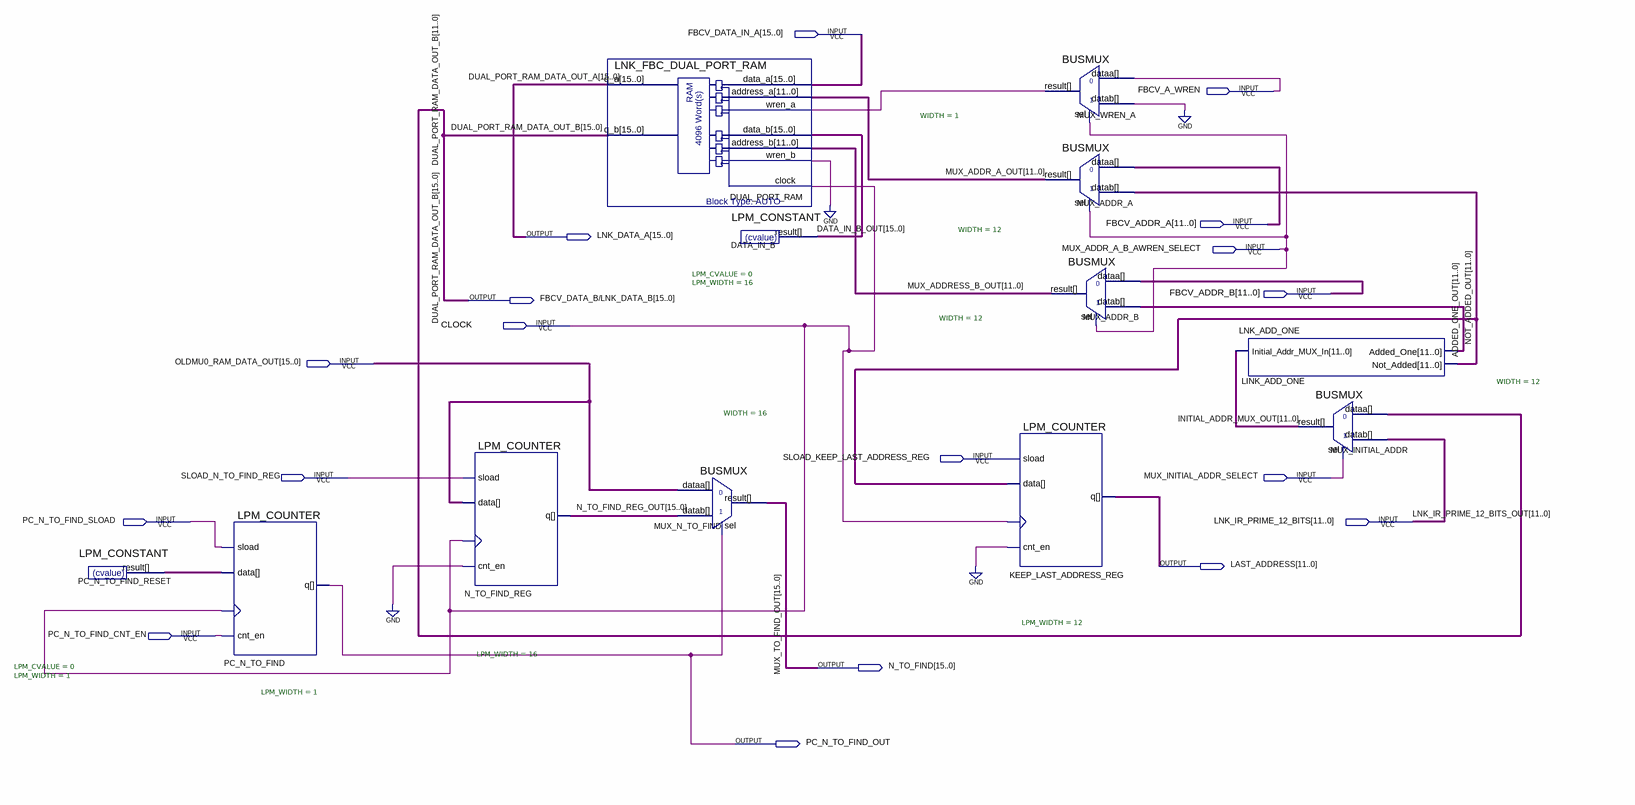
[diagram p0: schematic sheet]
// Quartus schematic LNK_FBC_DUAL_PORT_RAM_SCHEMATIC.bdf as structural Verilog: 12 symbols, 18 pins
module LNK_FBC_DUAL_PORT_RAM_SCHEMATIC (
  input  [15:0] FBCV_DATA_IN_A,
  input  FBCV_A_WREN,
  input  [11:0] FBCV_ADDR_A,
  input  MUX_ADDR_A_B_AWREN_SELECT,
  input  [11:0] FBCV_ADDR_B,
  input  CLOCK,
  input  [15:0] OLDMU0_RAM_DATA_OUT,
  input  SLOAD_KEEP_LAST_ADDRESS_REG,
  input  SLOAD_N_TO_FIND_REG,
  input  MUX_INITIAL_ADDR_SELECT,
  input  PC_N_TO_FIND_SLOAD,
  input  [11:0] LNK_IR_PRIME_12_BITS,
  input  PC_N_TO_FIND_CNT_EN,
  output [15:0] LNK_DATA_A,
  output [15:0] \FBCV_DATA_B/LNK_DATA_B ,
  output [11:0] LAST_ADDRESS,
  output [15:0] N_TO_FIND,
  output PC_N_TO_FIND_OUT
);

  wire MUX_WREN_A_result, PC_N_TO_FIND_RESET_result;
  wire [11:0] ADDED_ONE_OUT, INITIAL_ADDR_MUX_OUT, MUX_ADDR_A_OUT, MUX_ADDRESS_B_OUT, NOT_ADDED_OUT;
  wire [15:0] DATA_IN_B_OUT, N_TO_FIND_REG_OUT;

  LPM_CONSTANT #(.LPM_CVALUE(0), .LPM_WIDTH(1)) PC_N_TO_FIND_RESET (.result(PC_N_TO_FIND_RESET_result));
  LPM_COUNTER #(.LPM_WIDTH(1)) PC_N_TO_FIND (
    .clock(CLOCK), .cnt_en(PC_N_TO_FIND_CNT_EN), .data(PC_N_TO_FIND_RESET_result),
    .sload(PC_N_TO_FIND_SLOAD), .q(PC_N_TO_FIND_OUT));
  LPM_COUNTER #(.LPM_WIDTH(16)) N_TO_FIND_REG (
    .clock(CLOCK), .cnt_en(1'b0), .data(OLDMU0_RAM_DATA_OUT), .sload(SLOAD_N_TO_FIND_REG),
    .q(N_TO_FIND_REG_OUT));
  LNK_FBC_DUAL_PORT_RAM DUAL_PORT_RAM (
    .data_a(FBCV_DATA_IN_A), .address_a(MUX_ADDR_A_OUT), .wren_a(MUX_WREN_A_result), .data_b(DATA_IN_B_OUT),
    .address_b(MUX_ADDRESS_B_OUT), .wren_b(1'b0), .clock(CLOCK), .q_a(LNK_DATA_A),
    .q_b(\FBCV_DATA_B/LNK_DATA_B ));
  BUSMUX #(.WIDTH(16)) MUX_N_TO_FIND (
    .datab(N_TO_FIND_REG_OUT), .sel(PC_N_TO_FIND_OUT), .dataa(OLDMU0_RAM_DATA_OUT), .result(N_TO_FIND));
  LPM_CONSTANT #(.LPM_CVALUE(0), .LPM_WIDTH(16)) DATA_IN_B (.result(DATA_IN_B_OUT));
  LPM_COUNTER #(.LPM_WIDTH(12)) KEEP_LAST_ADDRESS_REG (
    .clock(CLOCK), .cnt_en(1'b0), .data(NOT_ADDED_OUT), .sload(SLOAD_KEEP_LAST_ADDRESS_REG), .q(LAST_ADDRESS));
  BUSMUX #(.WIDTH(1)) MUX_WREN_A (
    .datab(1'b0), .sel(MUX_ADDR_A_B_AWREN_SELECT), .dataa(FBCV_A_WREN), .result(MUX_WREN_A_result));
  BUSMUX #(.WIDTH(12)) MUX_ADDR_A (
    .datab(NOT_ADDED_OUT), .sel(MUX_ADDR_A_B_AWREN_SELECT), .dataa(FBCV_ADDR_A), .result(MUX_ADDR_A_OUT));
  BUSMUX #(.WIDTH(12)) MUX_ADDR_B (
    .datab(ADDED_ONE_OUT), .sel(MUX_ADDR_A_B_AWREN_SELECT), .dataa(FBCV_ADDR_B), .result(MUX_ADDRESS_B_OUT));
  LNK_ADD_ONE LINK_ADD_ONE (
    .Initial_Addr_MUX_In(INITIAL_ADDR_MUX_OUT), .Added_One(ADDED_ONE_OUT), .Not_Added(NOT_ADDED_OUT));
  BUSMUX #(.WIDTH(12)) MUX_INITIAL_ADDR (
    .datab(LNK_IR_PRIME_12_BITS), .sel(MUX_INITIAL_ADDR_SELECT), .dataa(\FBCV_DATA_B/LNK_DATA_B [11:0]),
    .result(INITIAL_ADDR_MUX_OUT));

  // Other names for the same wires on the sheet: DUAL_PORT_RAM_DATA_OUT_B[15:0] = \FBCV_DATA_B/LNK_DATA_B ;
  //   DUAL_PORT_RAM_DATA_OUT_A[15:0] = LNK_DATA_A; LNK_IR_PRIME_12_BITS_OUT[11:0] = LNK_IR_PRIME_12_BITS;
  //   MUX_TO_FIND_OUT[15:0] = N_TO_FIND
endmodule
